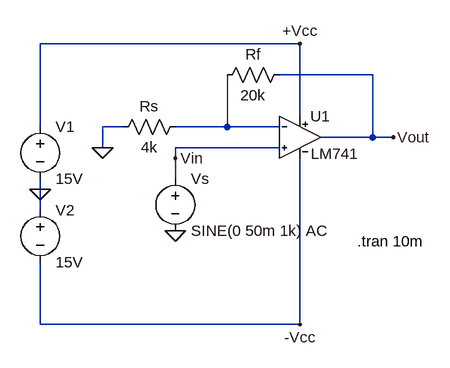
[diagram p0: schematic Non_inverting.asc]
Non_inverting.asc, the LTspice schematic file:
Version 4
SHEET 1 880 680
WIRE 208 16 -192 16
WIRE 320 64 176 64
WIRE 208 128 208 16
WIRE -192 144 -192 16
WIRE -64 144 -96 144
WIRE 96 144 96 64
WIRE 96 144 16 144
WIRE 176 144 96 144
WIRE 320 160 320 64
WIRE 320 160 240 160
WIRE 352 160 320 160
WIRE -96 176 -96 144
WIRE 176 176 16 176
WIRE 16 192 16 176
WIRE 16 224 16 192
WIRE -192 240 -192 224
WIRE -192 272 -192 240
WIRE -192 448 -192 352
WIRE 208 448 208 192
WIRE 208 448 -192 448
FLAG 16 304 0
FLAG -192 240 0
FLAG 208 16 +Vcc
FLAG 208 448 -Vcc
FLAG -96 176 0
FLAG 16 192 Vin
FLAG 352 160 Vout
SYMBOL LM741 208 96 R0
SYMATTR InstName U1
SYMBOL voltage 16 208 R0
WINDOW 123 0 0 Left 0
WINDOW 39 0 0 Left 0
SYMATTR InstName Vs
SYMATTR Value SINE(0 50m 1k) AC
SYMBOL voltage -192 128 R0
SYMATTR InstName V1
SYMATTR Value 15V
SYMBOL voltage -192 256 R0
SYMATTR InstName V2
SYMATTR Value 15V
SYMBOL res 32 128 R90
WINDOW 0 0 56 VBottom 2
WINDOW 3 32 56 VTop 2
SYMATTR InstName Rs
SYMATTR Value 4k
SYMBOL res 192 48 R90
WINDOW 0 0 56 VBottom 2
WINDOW 3 32 56 VTop 2
SYMATTR InstName Rf
SYMATTR Value 20k
TEXT 296 320 Left 2 !.tran 10m

The netlist it stands for:
* Non_inverting.asc
XU1 Vin N001 +Vcc -Vcc Vout LM741  ; pins In+ In- V+ V- OUT
Vs Vin 0 SINE(0 50m 1k) AC
V1 +Vcc 0 15V
V2 0 -Vcc 15V
Rs N001 0 4k
Rf Vout N001 20k
.tran 10m
.lib LM741.lib
.backanno
.end